# Altium project Sumobot 2007.PRJPCB
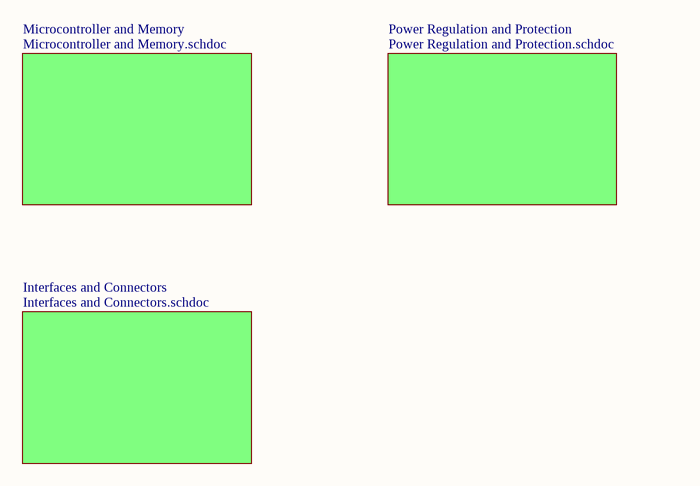
[diagram p0: Schematic of Schematics.SCHDOC]
4 sheets, 42 parts. Net scope: global (net labels, ports and power ports of the same name join across sheets).
Board file: PCB Layout.PCBDOC
Sheets:
  Schematic of Schematics.SCHDOC
    Microcontroller and Memory = Microcontroller and Memory.SCHDOC
    Interfaces and Connectors = Interfaces and Connectors.SCHDOC
    Power Regulation and Protection = Power Regulation and Protection.SCHDOC

## Sheet Schematic of Schematics.SCHDOC
size A4

### Sub-sheets
Interfaces and Connectors = Interfaces and Connectors.schdoc: no entries
Microcontroller and Memory = Microcontroller and Memory.schdoc: no entries
Power Regulation and Protection = Power Regulation and Protection.schdoc: no entries

## Sheet Microcontroller and Memory.SCHDOC
size A4
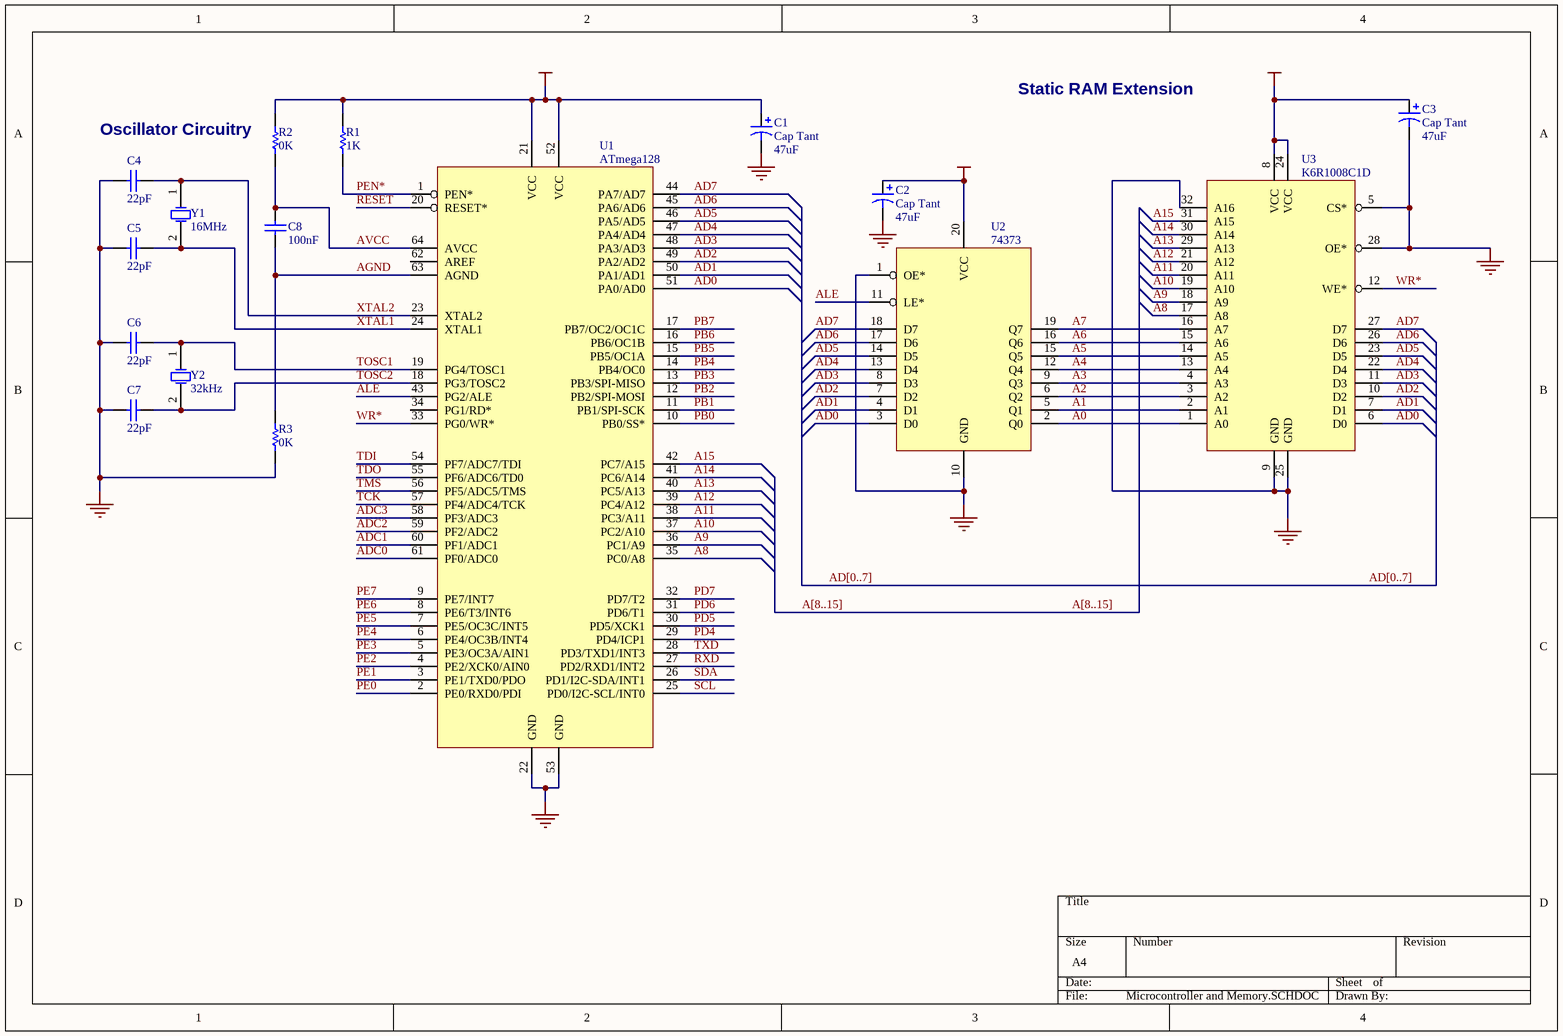
[diagram p1: Microcontroller and Memory.SCHDOC]

### Parts
C1  Cap Tant  value 47uF  [CAPR5-4X5]
C2  Cap Tant  value 47uF  [CAPR5-4X5]
C3  Cap Tant  value 47uF  [CAPR5-4X5]
C4  22pF  [BCY-W2/D3.1]
C5  22pF  [BCY-W2/D3.1]
C6  22pF  [BCY-W2/D3.1]
C7  22pF  [BCY-W2/D3.1]
C8  100nF  [BCY-W2/D3.1]
R1  1K  [AXIAL-0.3]
R2  0K  [AXIAL-0.3]
R3  0K  [AXIAL-0.3]
U1  ATmega128  [QFP14x14-G64/Y1.4N]
U2  74373  [SO-G20/Y1.45]
U3  K6R1008C1D  [SO-G32/Y1.45]
Y1  16MHz  [BCY-W2/D3.1]
Y2  32kHz  [BCY-W2/D3.1]

### Nets
5V: C1.1 C2.1 C3.1 R1.2 R2.2 U1.21(VCC) U1.52(VCC) U2.20(VCC) U3.8(VCC) U3.24(VCC)
GND: C1.2 C2.2 C3.2 C4.1 C5.1 C6.1 C7.1 R3.1 U1.22(GND) U1.53(GND) U2.1(OE*) U2.10(GND) U3.5(CS*) U3.9(GND) U3.25(GND) U3.28(OE*) U3.32(A16)
A0: U2.2(Q0) U3.1(A0)
A1: U2.5(Q1) U3.2(A1)
A2: U2.6(Q2) U3.3(A2)
A3: U2.9(Q3) U3.4(A3)
A4: U2.12(Q4) U3.13(A4)
A5: U2.15(Q5) U3.14(A5)
A6: U2.16(Q6) U3.15(A6)
A7: U2.19(Q7) U3.16(A7)
A8: U1.35(PC0/A8) U3.17(A8)
A9: U1.36(PC1/A9) U3.18(A9)
A10: U1.37(PC2/A10) U3.19(A10)
A11: U1.38(PC3/A11) U3.20(A11)
A12: U1.39(PC4/A12) U3.21(A12)
A13: U1.40(PC5/A13) U3.29(A13)
A14: U1.41(PC6/A14) U3.30(A14)
A15: U1.42(PC7/A15) U3.31(A15)
AD0: U1.51(PA0/AD0) U2.3(D0) U3.6(D0)
AD1: U1.50(PA1/AD1) U2.4(D1) U3.7(D1)
AD2: U1.49(PA2/AD2) U2.7(D2) U3.10(D2)
AD3: U1.48(PA3/AD3) U2.8(D3) U3.11(D3)
AD4: U1.47(PA4/AD4) U2.13(D4) U3.22(D4)
AD5: U1.46(PA5/AD5) U2.14(D5) U3.23(D5)
AD6: U1.45(PA6/AD6) U2.17(D6) U3.26(D6)
AD7: U1.44(PA7/AD7) U2.18(D7) U3.27(D7)
ADC0: U1.61(PF0/ADC0)
ADC1: U1.60(PF1/ADC1)
ADC2: U1.59(PF2/ADC2)
ADC3: U1.58(PF3/ADC3)
AGND: C8.1 R3.2 U1.63(AGND)
ALE: U1.43(PG2/ALE) U2.11(LE*)
AVCC: C8.2 R2.1 U1.64(AVCC)
PB0: U1.10(PB0/SS*)
PB1: U1.11(PB1/SPI-SCK)
PB2: U1.12(PB2/SPI-MOSI)
PB3: U1.13(PB3/SPI-MISO)
PB4: U1.14(PB4/OC0)
PB5: U1.15(PB5/OC1A)
PB6: U1.16(PB6/OC1B)
PB7: U1.17(PB7/OC2/OC1C)
PD4: U1.29(PD4/ICP1)
PD5: U1.30(PD5/XCK1)
PD6: U1.31(PD6/T1)
PD7: U1.32(PD7/T2)
PE0: U1.2(PE0/RXD0/PDI)
PE1: U1.3(PE1/TXD0/PDO)
PE2: U1.4(PE2/XCK0/AIN0)
PE3: U1.5(PE3/OC3A/AIN1)
PE4: U1.6(PE4/OC3B/INT4)
PE5: U1.7(PE5/OC3C/INT5)
PE6: U1.8(PE6/T3/INT6)
PE7: U1.9(PE7/INT7)
PEN*: R1.1 U1.1(PEN*)
RESET: U1.20(RESET*)
RXD: U1.27(PD2/RXD1/INT2)
SCL: U1.25(PD0/I2C-SCL/INT0)
SDA: U1.26(PD1/I2C-SDA/INT1)
TCK: U1.57(PF4/ADC4/TCK)
TDI: U1.54(PF7/ADC7/TDI)
TDO: U1.55(PF6/ADC6/TD0)
TMS: U1.56(PF5/ADC5/TMS)
TOSC1: C6.2 U1.19(PG4/TOSC1) Y2.1(OSC1)
TOSC2: C7.2 U1.18(PG3/TOSC2) Y2.2(OSC2)
TXD: U1.28(PD3/TXD1/INT3)
WR*: U1.33(PG0/WR*) U3.12(WE*)
XTAL1: C5.2 U1.24(XTAL1) Y1.2(OSC2)
XTAL2: C4.2 U1.23(XTAL2) Y1.1(OSC1)

Not connected (* = marked no-connect by the designer): U1 34(PG1/RD*) 62(AREF)

### Buses and harness runs
bus A[8..15]
bus AD[0..7]

### Notes on the sheet
- Static RAM Extension
- (near R2) Oscillator Circuitry

### Library data of the parts
C1-C3 = Cap Pol2: Polarized Capacitor (Axial); Published: 8-Jun-2000; Revision: July-2002: Re-released for DXP Platform.; Publisher: Altium Limited
C4-C8 = Cap: Capacitor; Published: 8-Jun-2000; Revision: July-2002: Re-released for DXP Platform.; Publisher: Altium Limited
R1-R3 = Res1: Resistor; Published: 8-Jun-2000; Revision: July-2002: Re-released for DXP Platform.; Publisher: Altium Limited
U1 = ATmega128: Atmel ATmega128 MCU
U2 = 74373: Octal 8-bit D-type Latch
U3 = K6R1008C1D: Samsung 128Kx8 High-Speed Static RAM
Y1 Y2 = XTAL: Crystal Oscillator; Published: 8-Jun-2000; Revision: July-2002: Re-released for DXP Platform.; Publisher: Altium Limited

## Sheet Interfaces and Connectors.SCHDOC
size A4
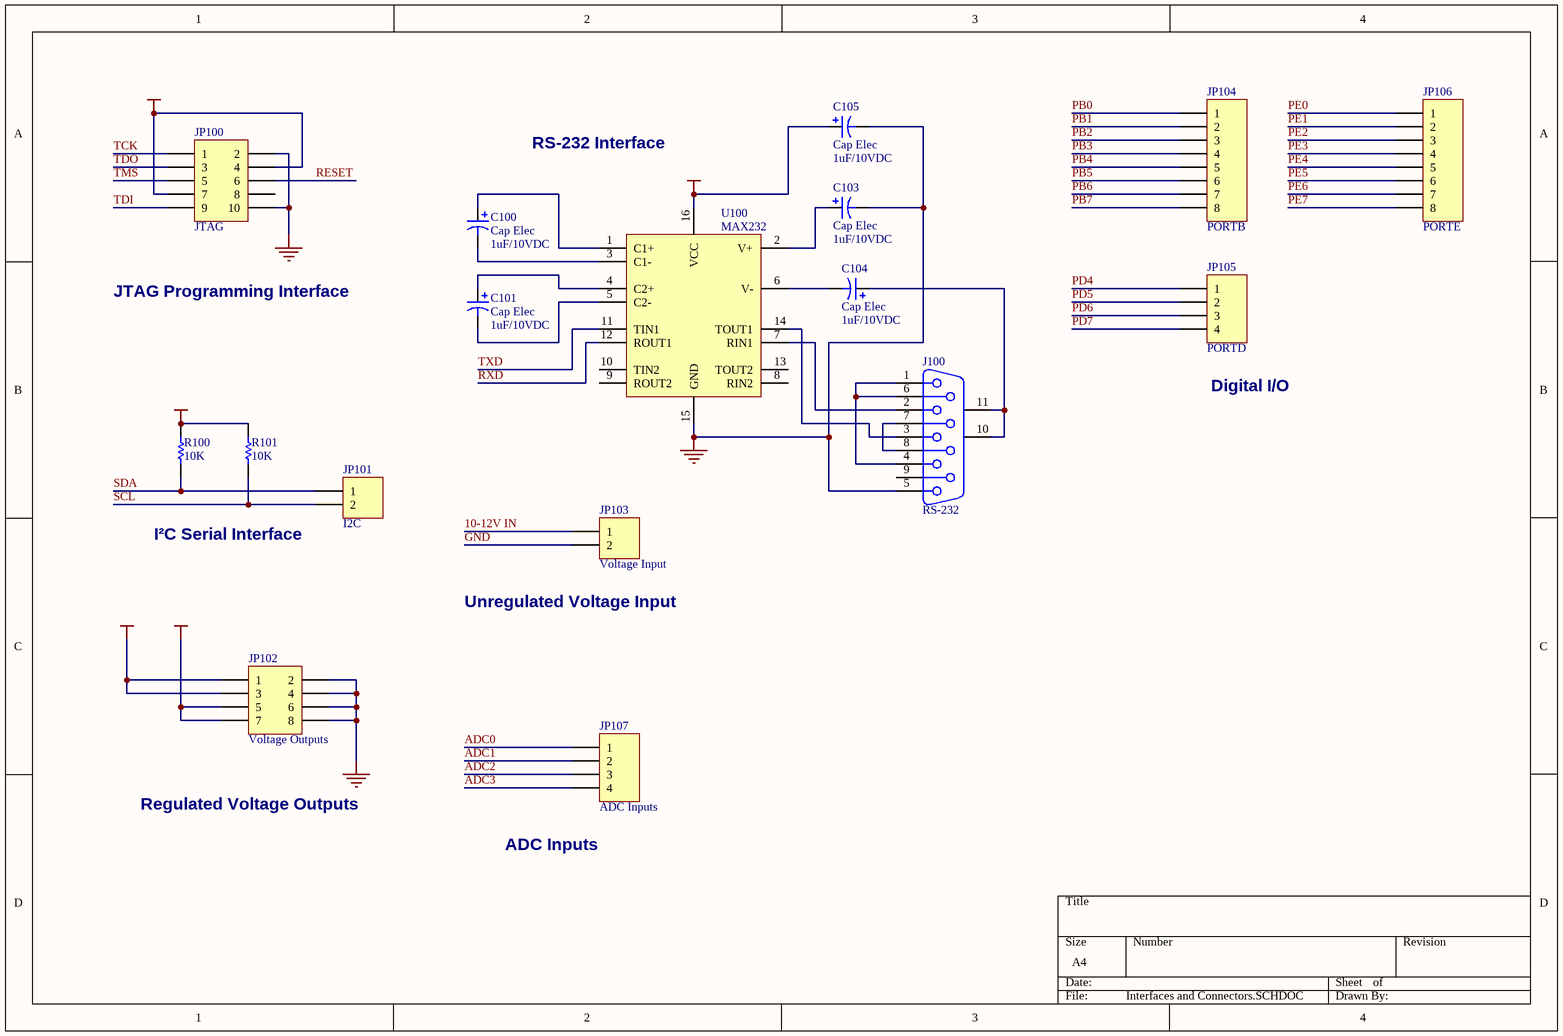
[diagram p2: Interfaces and Connectors.SCHDOC]

### Parts
C100  Cap Elec  value 1uF/10VDC  [CAPR5-4X5]
C101  Cap Elec  value 1uF/10VDC  [CAPR5-4X5]
C103  Cap Elec  value 1uF/10VDC  [CAPR5-4X5]
C104  Cap Elec  value 1uF/10VDC  [CAPR5-4X5]
C105  Cap Elec  value 1uF/10VDC  [CAPR5-4X5]
J100  RS-232  [DSUB1.385-2H9]
JP100  JTAG  [HDR2X5]
JP101  I2C  [HDR1X2]
JP102  Voltage Outputs  [HDR2X4]
JP103  Voltage Input  [HDR1X2]
JP104  PORTB  [HDR1X8]
JP105  PORTD  [HDR1X4]
JP106  PORTE  [HDR1X8]
JP107  ADC Inputs  [HDR1X4]
R100  10K  [AXIAL-0.3]
R101  10K  [AXIAL-0.3]
U100  MAX232  [SO-G16/C5.85]

### Nets
5V: C105.1 JP100.4 JP100.7 JP102.5 JP102.7 R100.2 R101.2 U100.16(VCC)
9V: JP102.1 JP102.3
10-12V IN: JP103.1
GND: C103.2 C105.2 J100.5 JP100.2 JP100.10 JP102.2 JP102.4 JP102.6 JP102.8 JP103.2 U100.15(GND)
ADC0: JP107.1
ADC1: JP107.2
ADC2: JP107.3
ADC3: JP107.4
PB0: JP104.1
PB1: JP104.2
PB2: JP104.3
PB3: JP104.4
PB4: JP104.5
PB5: JP104.6
PB6: JP104.7
PB7: JP104.8
PD4: JP105.1
PD5: JP105.2
PD6: JP105.3
PD7: JP105.4
PE0: JP106.1
PE1: JP106.2
PE2: JP106.3
PE3: JP106.4
PE4: JP106.5
PE5: JP106.6
PE6: JP106.7
PE7: JP106.8
RESET: JP100.6
RXD: U100.12(ROUT1)
SCL: JP101.2 R101.1
SDA: JP101.1 R100.1
TCK: JP100.1
TDI: JP100.9
TDO: JP100.3
TMS: JP100.5
TXD: U100.11(TIN1)
NetC100_1: C100.1 U100.1(C1+)
NetC100_2: C100.2 U100.3(C1-)
NetC101_1: C101.1 U100.4(C2+)
NetC101_2: C101.2 U100.5(C2-)
NetC103_1: C103.1 U100.2(V+)
NetC104_1: C104.1 J100.10(MH1) J100.11(MH2)
NetC104_2: C104.2 U100.6(V-)
NetJ100_1: J100.1 J100.4 J100.6
NetJ100_2: J100.2 U100.7(RIN1)
NetJ100_3: J100.3 U100.14(TOUT1)
NetJ100_7: J100.7 J100.8

Not connected (* = marked no-connect by the designer): J100 9; JP100 8; U100 8(RIN2) 9(ROUT2) 10(TIN2) 13(TOUT2)

### Notes on the sheet
- RS-232 Interface
- JTAG Programming Interface
- (near JP105) Digital I/O
- (near JP101) I²C Serial Interface
- (near JP103) Unregulated Voltage Input
- Regulated Voltage Outputs
- (near JP107) ADC Inputs

### Library data of the parts
C100 C101 C103-C105 = Cap Pol2: Polarized Capacitor (Axial); Published: 8-Jun-2000; Revision: July-2002: Re-released for DXP Platform.; Publisher: Altium Limited
J100 = D Connector 9: Receptacle Assembly, 9 Position, Right Angle; Package Information: Latest Revision: O; Positions: 9; Published: 15-Jun-2001; Revision: 17-Jul-2002: Re-released for DXP Platform.; Datasheet: (1-Sep-1999); Package Reference: 788750; Publisher: Altium Limited; Orientation: Right Angle; Gender: Receptacle
JP100 = Header 5X2: Header, 5-Pin, Dual row; Revision: 17-Jul-2002: Re-released for DXP Platform.; Publisher: Altium Limited
JP101 JP103 = Header 2: Header, 2-Pin; Revision: 17-Jul-2002: Re-released for DXP Platform.; Publisher: Altium Limited
JP102 = Header 4X2: Header, 4-Pin, Dual row; Revision: 17-Jul-2002: Re-released for DXP Platform.; Publisher: Altium Limited
JP104 JP106 = Header 8: Header, 8-Pin; Revision: 17-Jul-2002: Re-released for DXP Platform.; Publisher: Altium Limited
JP105 JP107 = Header 4: Header, 4-Pin; Revision: 17-Jul-2002: Re-released for DXP Platform.; Publisher: Altium Limited
R100 R101 = Res1: Resistor; Published: 8-Jun-2000; Revision: July-2002: Re-released for DXP Platform.; Publisher: Altium Limited
U100 = MAX232: Maxim RS-232 Transceiver

## Sheet Power Regulation and Protection.SCHDOC
size A4
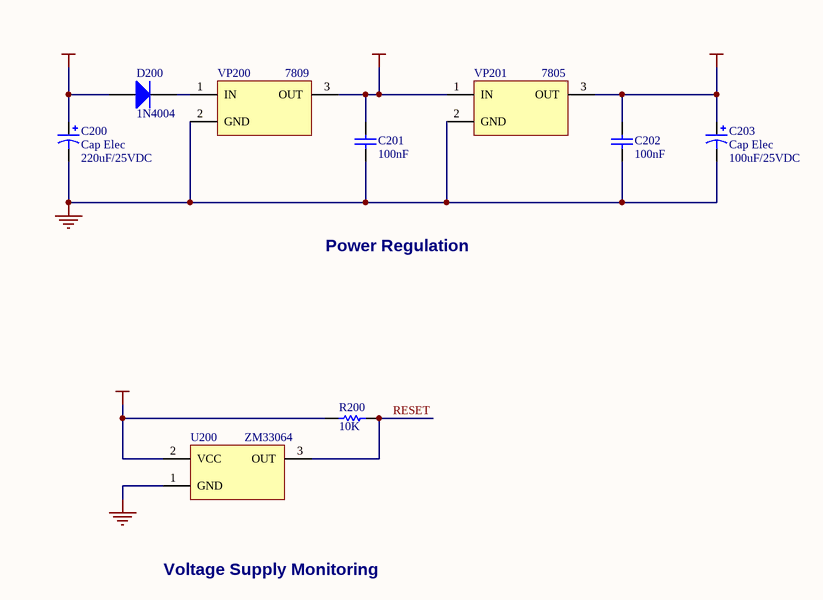
[diagram p3: Power Regulation and Protection.SCHDOC]

### Parts
C200  Cap Elec  value 220uF/25VDC  [CAPR5-4X5]
C201  100nF  [BCY-W2/D3.1]
C202  100nF  [BCY-W2/D3.1]
C203  Cap Elec  value 100uF/25VDC  [CAPR5-4X5]
D200  1N4004  [DIO10.46-5.3x2.8]
R200  10K  [AXIAL-0.3]
U200  ZM33064  [BCY-W3]
VP200  7809  [PIN3]
VP201  7805  [PIN3]

### Nets
5V: C202.2 C203.1 R200.2 U200.2(VCC) VP201.3(OUT)
9V: C201.2 VP200.3(OUT) VP201.1(IN)
10-12V IN: C200.1 D200.1(A)
GND: C200.2 C201.1 C202.1 C203.2 U200.1(GND) VP200.2(GND) VP201.2(GND)
RESET: R200.1 U200.3(OUT)
NetD200_2: D200.2(K) VP200.1(IN)

### Notes on the sheet
- Power Regulation
- Voltage Supply Monitoring

### Library data of the parts
C200 C203 = Cap Pol2: Polarized Capacitor (Axial); Published: 8-Jun-2000; Revision: July-2002: Re-released for DXP Platform.; Publisher: Altium Limited
C201 C202 = Cap: Capacitor; Published: 8-Jun-2000; Revision: July-2002: Re-released for DXP Platform.; Publisher: Altium Limited
D200 = Diode 1N4004: 1 Amp General Purpose Rectifier; Revision 1: 11-Jul-2000: SIM Model Added.; Revision 2: 17-Jul-2002: Re-released for DXP Platform.; Package Information: Latest Revision: Aug-1999; Code - JEDEC: DO-204-AL; Published: 8-Jun-2000; Datasheet: Latest Revision: 1998; Package Reference: DO-41; Publisher: Altium Limited
R200 = Res1: Resistor; Published: 8-Jun-2000; Revision: July-2002: Re-released for DXP Platform.; Publisher: Altium Limited
U200 = ZM33064: Generic 5V Supply Voltage Monitor
VP200 = 7809: Generic 9V Voltage Regulator
VP201 = 7805: Generic 6V Voltage Regulator

## Nets that join several sheets
5V: Microcontroller and Memory (10 pins), Interfaces and Connectors (8 pins), Power Regulation and Protection (5 pins)
9V: Interfaces and Connectors (JP102.1 JP102.3), Power Regulation and Protection (C201.2 VP200.3 VP201.1)
10-12V IN: Interfaces and Connectors (JP103.1), Power Regulation and Protection (C200.1 D200.1)
GND: Microcontroller and Memory (17 pins), Interfaces and Connectors (11 pins), Power Regulation and Protection (7 pins)
ADC0: Microcontroller and Memory (U1.61), Interfaces and Connectors (JP107.1)
ADC1: Microcontroller and Memory (U1.60), Interfaces and Connectors (JP107.2)
ADC2: Microcontroller and Memory (U1.59), Interfaces and Connectors (JP107.3)
ADC3: Microcontroller and Memory (U1.58), Interfaces and Connectors (JP107.4)
PB0: Microcontroller and Memory (U1.10), Interfaces and Connectors (JP104.1)
PB1: Microcontroller and Memory (U1.11), Interfaces and Connectors (JP104.2)
PB2: Microcontroller and Memory (U1.12), Interfaces and Connectors (JP104.3)
PB3: Microcontroller and Memory (U1.13), Interfaces and Connectors (JP104.4)
PB4: Microcontroller and Memory (U1.14), Interfaces and Connectors (JP104.5)
PB5: Microcontroller and Memory (U1.15), Interfaces and Connectors (JP104.6)
PB6: Microcontroller and Memory (U1.16), Interfaces and Connectors (JP104.7)
PB7: Microcontroller and Memory (U1.17), Interfaces and Connectors (JP104.8)
PD4: Microcontroller and Memory (U1.29), Interfaces and Connectors (JP105.1)
PD5: Microcontroller and Memory (U1.30), Interfaces and Connectors (JP105.2)
PD6: Microcontroller and Memory (U1.31), Interfaces and Connectors (JP105.3)
PD7: Microcontroller and Memory (U1.32), Interfaces and Connectors (JP105.4)
PE0: Microcontroller and Memory (U1.2), Interfaces and Connectors (JP106.1)
PE1: Microcontroller and Memory (U1.3), Interfaces and Connectors (JP106.2)
PE2: Microcontroller and Memory (U1.4), Interfaces and Connectors (JP106.3)
PE3: Microcontroller and Memory (U1.5), Interfaces and Connectors (JP106.4)
PE4: Microcontroller and Memory (U1.6), Interfaces and Connectors (JP106.5)
PE5: Microcontroller and Memory (U1.7), Interfaces and Connectors (JP106.6)
PE6: Microcontroller and Memory (U1.8), Interfaces and Connectors (JP106.7)
PE7: Microcontroller and Memory (U1.9), Interfaces and Connectors (JP106.8)
RESET: Microcontroller and Memory (U1.20), Interfaces and Connectors (JP100.6), Power Regulation and Protection (R200.1 U200.3)
RXD: Microcontroller and Memory (U1.27), Interfaces and Connectors (U100.12)
SCL: Microcontroller and Memory (U1.25), Interfaces and Connectors (JP101.2 R101.1)
SDA: Microcontroller and Memory (U1.26), Interfaces and Connectors (JP101.1 R100.1)
TCK: Microcontroller and Memory (U1.57), Interfaces and Connectors (JP100.1)
TDI: Microcontroller and Memory (U1.54), Interfaces and Connectors (JP100.9)
TDO: Microcontroller and Memory (U1.55), Interfaces and Connectors (JP100.3)
TMS: Microcontroller and Memory (U1.56), Interfaces and Connectors (JP100.5)
TXD: Microcontroller and Memory (U1.28), Interfaces and Connectors (U100.11)